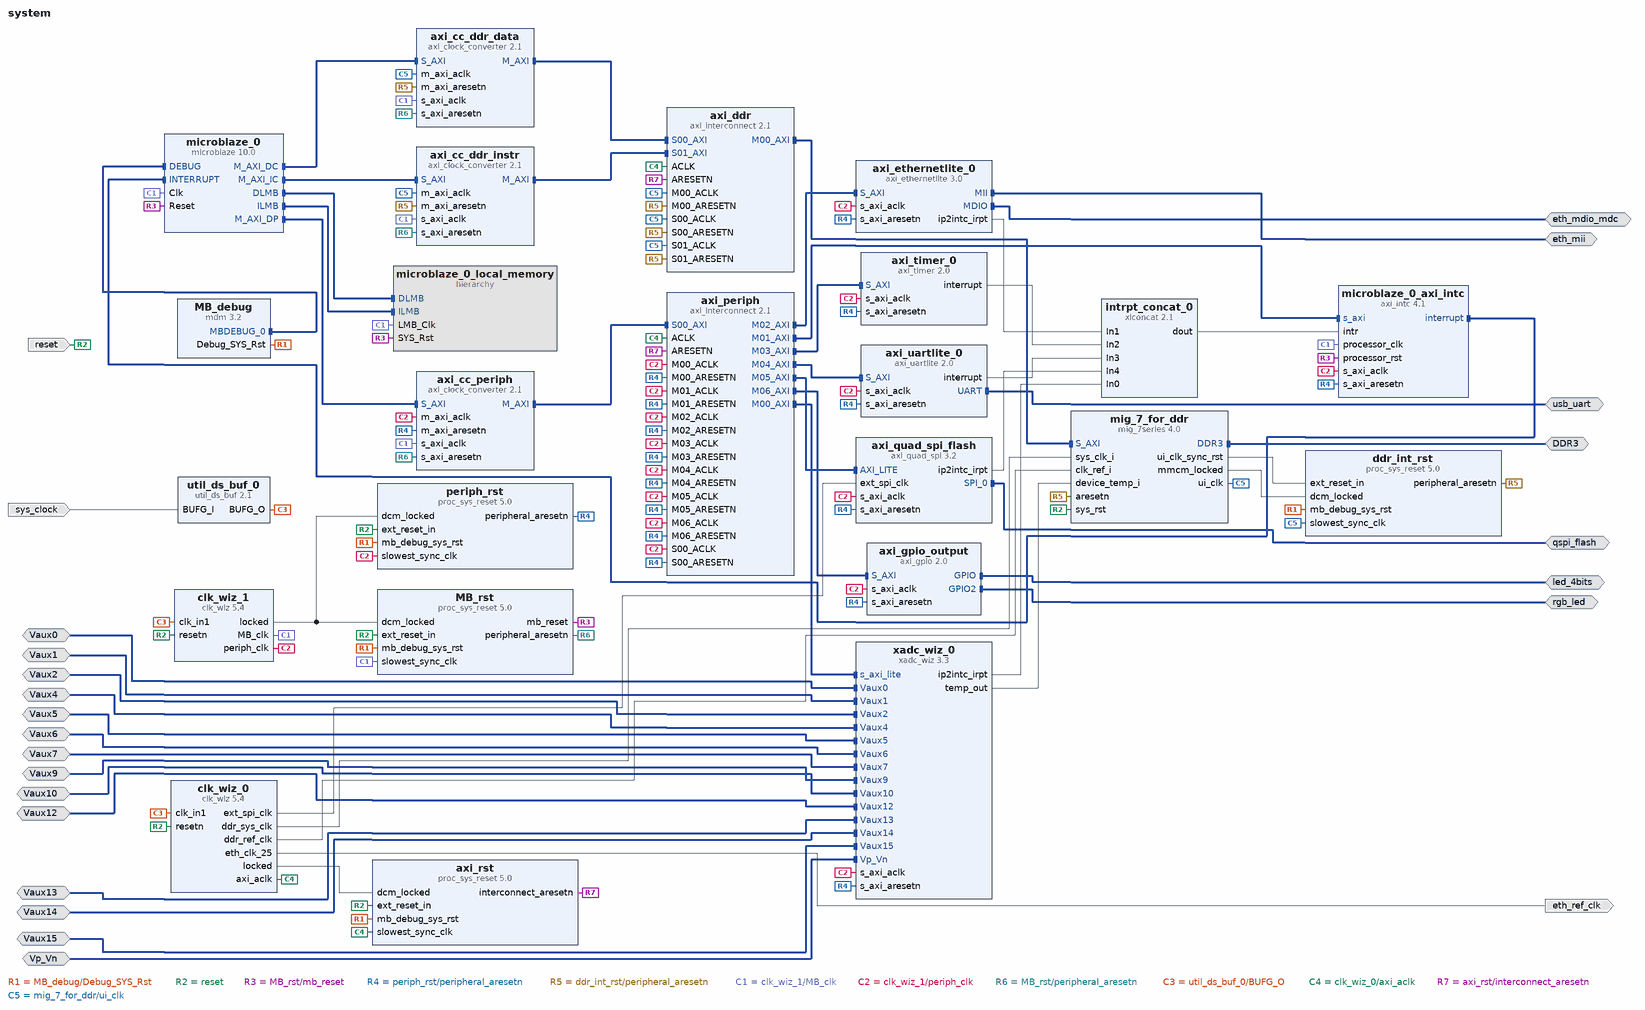
[diagram p0: block diagram of the top level]
# Vivado block design system, xc7a35ticsg324-1L, Vivado 2017.2
create_bd_design system

create_bd_intf_port -mode Master -vlnv xilinx.com:interface:ddrx_rtl:1.0 DDR3
create_bd_intf_port -mode Slave -vlnv xilinx.com:interface:diff_analog_io_rtl:1.0 Vaux0
create_bd_intf_port -mode Slave -vlnv xilinx.com:interface:diff_analog_io_rtl:1.0 Vaux1
create_bd_intf_port -mode Slave -vlnv xilinx.com:interface:diff_analog_io_rtl:1.0 Vaux2
create_bd_intf_port -mode Slave -vlnv xilinx.com:interface:diff_analog_io_rtl:1.0 Vaux4
create_bd_intf_port -mode Slave -vlnv xilinx.com:interface:diff_analog_io_rtl:1.0 Vaux5
create_bd_intf_port -mode Slave -vlnv xilinx.com:interface:diff_analog_io_rtl:1.0 Vaux6
create_bd_intf_port -mode Slave -vlnv xilinx.com:interface:diff_analog_io_rtl:1.0 Vaux7
create_bd_intf_port -mode Slave -vlnv xilinx.com:interface:diff_analog_io_rtl:1.0 Vaux9
create_bd_intf_port -mode Slave -vlnv xilinx.com:interface:diff_analog_io_rtl:1.0 Vaux10
create_bd_intf_port -mode Slave -vlnv xilinx.com:interface:diff_analog_io_rtl:1.0 Vaux12
create_bd_intf_port -mode Slave -vlnv xilinx.com:interface:diff_analog_io_rtl:1.0 Vaux13
create_bd_intf_port -mode Slave -vlnv xilinx.com:interface:diff_analog_io_rtl:1.0 Vaux14
create_bd_intf_port -mode Slave -vlnv xilinx.com:interface:diff_analog_io_rtl:1.0 Vaux15
create_bd_intf_port -mode Slave -vlnv xilinx.com:interface:diff_analog_io_rtl:1.0 Vp_Vn
create_bd_intf_port -mode Master -vlnv xilinx.com:interface:gpio_rtl:1.0 led_4bits
create_bd_intf_port -mode Master -vlnv xilinx.com:interface:spi_rtl:1.0 qspi_flash
create_bd_intf_port -mode Master -vlnv xilinx.com:interface:gpio_rtl:1.0 rgb_led
create_bd_intf_port -mode Master -vlnv xilinx.com:interface:uart_rtl:1.0 usb_uart
create_bd_intf_port -mode Master -vlnv xilinx.com:interface:mii_rtl:1.0 eth_mii
create_bd_intf_port -mode Master -vlnv xilinx.com:interface:mdio_rtl:1.0 eth_mdio_mdc
create_bd_port -dir I -type rst reset
set_property -dict {CONFIG.POLARITY ACTIVE_LOW} [get_bd_ports reset]
create_bd_port -dir O -type clk eth_ref_clk
create_bd_port -dir I -type clk sys_clock
set_property -dict {CONFIG.FREQ_HZ 100000000 CONFIG.PHASE 0.000} [get_bd_ports sys_clock]

create_bd_cell -type ip -vlnv xilinx.com:ip:axi_interconnect:2.1 axi_ddr
set_property -dict [list \
  CONFIG.NUM_SI 2 \
  CONFIG.NUM_MI 1 \
  CONFIG.STRATEGY 2 \
  CONFIG.ENABLE_ADVANCED_OPTIONS 1 \
  CONFIG.M00_HAS_DATA_FIFO 2 \
  CONFIG.S00_HAS_DATA_FIFO 2 \
  CONFIG.S01_HAS_DATA_FIFO 2 \
] [get_bd_cells axi_ddr]
create_bd_cell -type ip -vlnv xilinx.com:ip:axi_timer:2.0 axi_timer_0
create_bd_cell -type ip -vlnv xilinx.com:ip:mdm:3.2 MB_debug
create_bd_cell -type ip -vlnv xilinx.com:ip:microblaze:10.0 microblaze_0
set_property -dict [list \
  CONFIG.C_AREA_OPTIMIZED 2 \
  CONFIG.C_D_AXI 1 \
  CONFIG.C_D_LMB 1 \
  CONFIG.C_I_AXI 0 \
  CONFIG.C_I_LMB 1 \
  CONFIG.G_TEMPLATE_LIST 5 \
  CONFIG.G_USE_EXCEPTIONS 1 \
  CONFIG.C_USE_MSR_INSTR 1 \
  CONFIG.C_USE_PCMP_INSTR 1 \
  CONFIG.C_USE_BARREL 1 \
  CONFIG.C_USE_DIV 0 \
  CONFIG.C_USE_HW_MUL 1 \
  CONFIG.C_USE_FPU 0 \
  CONFIG.C_UNALIGNED_EXCEPTIONS 1 \
  CONFIG.C_ILL_OPCODE_EXCEPTION 1 \
  CONFIG.C_M_AXI_I_BUS_EXCEPTION 1 \
  CONFIG.C_M_AXI_D_BUS_EXCEPTION 1 \
  CONFIG.C_PVR 0 \
  CONFIG.C_DEBUG_ENABLED 1 \
  CONFIG.C_OPCODE_0x0_ILLEGAL 1 \
  CONFIG.C_USE_ICACHE 1 \
  CONFIG.C_ADDR_TAG_BITS 14 \
  CONFIG.C_CACHE_BYTE_SIZE 16384 \
  CONFIG.C_ICACHE_LINE_LEN 8 \
  CONFIG.C_ICACHE_VICTIMS 0 \
  CONFIG.C_ICACHE_STREAMS 0 \
  CONFIG.C_ICACHE_FORCE_TAG_LUTRAM 1 \
  CONFIG.C_USE_DCACHE 1 \
  CONFIG.C_DCACHE_ADDR_TAG 14 \
  CONFIG.C_DCACHE_BYTE_SIZE 16384 \
  CONFIG.C_DCACHE_LINE_LEN 8 \
  CONFIG.C_DCACHE_FORCE_TAG_LUTRAM 1 \
  CONFIG.C_USE_MMU 3 \
  CONFIG.C_MMU_DTLB_SIZE 4 \
  CONFIG.C_MMU_ITLB_SIZE 2 \
  CONFIG.C_MMU_ZONES 2 \
  CONFIG.C_USE_BRANCH_TARGET_CACHE 1 \
  CONFIG.C_BRANCH_TARGET_CACHE_SIZE 5 \
] [get_bd_cells microblaze_0]
create_bd_cell -type ip -vlnv xilinx.com:ip:axi_intc:4.1 microblaze_0_axi_intc
set_property -dict {CONFIG.C_IRQ_IS_LEVEL 0 CONFIG.C_HAS_FAST 1 CONFIG.C_ENABLE_ASYNC 1} [get_bd_cells microblaze_0_axi_intc]
create_bd_cell -type ip -vlnv xilinx.com:ip:axi_interconnect:2.1 axi_periph
set_property -dict [list \
  CONFIG.NUM_SI 1 \
  CONFIG.NUM_MI 7 \
  CONFIG.STRATEGY 2 \
  CONFIG.ENABLE_ADVANCED_OPTIONS 1 \
  CONFIG.M00_HAS_DATA_FIFO 0 \
  CONFIG.M01_HAS_DATA_FIFO 0 \
  CONFIG.M02_HAS_DATA_FIFO 0 \
  CONFIG.M03_HAS_DATA_FIFO 0 \
  CONFIG.M04_HAS_DATA_FIFO 0 \
  CONFIG.M05_HAS_DATA_FIFO 0 \
  CONFIG.M06_HAS_DATA_FIFO 0 \
  CONFIG.M07_HAS_DATA_FIFO 0 \
  CONFIG.M08_HAS_DATA_FIFO 1 \
  CONFIG.S00_HAS_DATA_FIFO 2 \
] [get_bd_cells axi_periph]
create_bd_cell -type hier microblaze_0_local_memory
create_bd_cell -type ip -vlnv xilinx.com:ip:xlconcat:2.1 intrpt_concat_0
set_property -dict {CONFIG.NUM_PORTS 5} [get_bd_cells intrpt_concat_0]
create_bd_cell -type ip -vlnv xilinx.com:ip:xadc_wiz:3.3 xadc_wiz_0
set_property -dict [list \
  CONFIG.INTERFACE_SELECTION Enable_AXI \
  CONFIG.XADC_STARUP_SELECTION channel_sequencer \
  CONFIG.SEQUENCER_MODE Continuous \
  CONFIG.ENABLE_RESET false \
  CONFIG.OT_ALARM false \
  CONFIG.USER_TEMP_ALARM true \
  CONFIG.VCCINT_ALARM true \
  CONFIG.VCCAUX_ALARM true \
  CONFIG.VCCINT_ALARM_LOWER 0.95 \
  CONFIG.VCCINT_ALARM_UPPER 0.98 \
  CONFIG.SINGLE_CHANNEL_SELECTION TEMPERATURE \
  CONFIG.EXTERNAL_MUX_CHANNEL VP_VN \
  CONFIG.CHANNEL_ENABLE_TEMPERATURE true \
  CONFIG.CHANNEL_ENABLE_VP_VN true \
  CONFIG.CHANNEL_ENABLE_VAUXP0_VAUXN0 true \
  CONFIG.CHANNEL_ENABLE_VAUXP1_VAUXN1 true \
  CONFIG.CHANNEL_ENABLE_VAUXP2_VAUXN2 true \
  CONFIG.CHANNEL_ENABLE_VAUXP4_VAUXN4 true \
  CONFIG.CHANNEL_ENABLE_VAUXP5_VAUXN5 true \
  CONFIG.CHANNEL_ENABLE_VAUXP6_VAUXN6 true \
  CONFIG.CHANNEL_ENABLE_VAUXP7_VAUXN7 true \
  CONFIG.CHANNEL_ENABLE_VAUXP9_VAUXN9 true \
  CONFIG.CHANNEL_ENABLE_VAUXP10_VAUXN10 true \
  CONFIG.CHANNEL_ENABLE_VAUXP11_VAUXN11 false \
  CONFIG.CHANNEL_ENABLE_VAUXP12_VAUXN12 true \
  CONFIG.CHANNEL_ENABLE_VAUXP13_VAUXN13 true \
  CONFIG.CHANNEL_ENABLE_VAUXP14_VAUXN14 true \
  CONFIG.CHANNEL_ENABLE_VAUXP15_VAUXN15 true \
  CONFIG.ENABLE_TEMP_BUS true \
] [get_bd_cells xadc_wiz_0]
create_bd_cell -type ip -vlnv xilinx.com:ip:axi_gpio:2.0 axi_gpio_output
set_property -dict [list \
  CONFIG.USE_BOARD_FLOW true \
  CONFIG.GPIO_BOARD_INTERFACE led_4bits \
  CONFIG.GPIO2_BOARD_INTERFACE rgb_led \
] [get_bd_cells axi_gpio_output]
create_bd_cell -type ip -vlnv xilinx.com:ip:axi_quad_spi:3.2 axi_quad_spi_flash
set_property -dict [list \
  CONFIG.C_SPI_MEMORY 2 \
  CONFIG.C_SPI_MODE 2 \
  CONFIG.C_FIFO_DEPTH 256 \
  CONFIG.C_TYPE_OF_AXI4_INTERFACE 0 \
  CONFIG.USE_BOARD_FLOW true \
  CONFIG.QSPI_BOARD_INTERFACE qspi_flash \
  CONFIG.C_S_AXI4_ID_WIDTH 0 \
] [get_bd_cells axi_quad_spi_flash]
create_bd_cell -type ip -vlnv xilinx.com:ip:clk_wiz:5.4 clk_wiz_0
set_property -dict [list \
  CONFIG.PRIMITIVE MMCM \
  CONFIG.CLKOUT2_USED true \
  CONFIG.CLKOUT3_USED true \
  CONFIG.CLKOUT4_USED true \
  CONFIG.CLKOUT5_USED true \
  CONFIG.CLKOUT6_USED false \
  CONFIG.CLKOUT7_USED false \
  CONFIG.NUM_OUT_CLKS 5 \
  CONFIG.CLK_OUT1_PORT ddr_sys_clk \
  CONFIG.CLK_OUT2_PORT ddr_ref_clk \
  CONFIG.CLK_OUT3_PORT eth_clk_25 \
  CONFIG.CLK_OUT4_PORT ext_spi_clk \
  CONFIG.CLK_OUT5_PORT axi_aclk \
  CONFIG.CLK_OUT6_PORT axi_ddr_clk_100 \
  CONFIG.CLK_OUT7_PORT ext_spi_clk \
  CONFIG.CLKOUT1_REQUESTED_OUT_FREQ 166.66666 \
  CONFIG.CLKOUT2_REQUESTED_OUT_FREQ 200.000 \
  CONFIG.CLKOUT3_REQUESTED_OUT_FREQ 25.000 \
  CONFIG.CLKOUT3_REQUESTED_PHASE 45 \
  CONFIG.CLKOUT4_REQUESTED_OUT_FREQ 100.000 \
  CONFIG.CLKOUT4_REQUESTED_PHASE 270 \
  CONFIG.CLKOUT5_REQUESTED_OUT_FREQ 100.000 \
  CONFIG.CLKOUT5_REQUESTED_PHASE 90 \
  CONFIG.CLKOUT6_REQUESTED_OUT_FREQ 100 \
  CONFIG.CLKOUT6_REQUESTED_PHASE 270 \
  CONFIG.CLKOUT7_REQUESTED_OUT_FREQ 100 \
  CONFIG.CLKOUT7_REQUESTED_PHASE 180 \
  CONFIG.PRIM_SOURCE Single_ended_clock_capable_pin \
  CONFIG.CLKOUT1_DRIVES BUFGCE \
  CONFIG.CLKOUT2_DRIVES BUFGCE \
  CONFIG.CLKOUT3_DRIVES BUFGCE \
  CONFIG.CLKOUT4_DRIVES BUFGCE \
  CONFIG.CLKOUT5_DRIVES BUFGCE \
  CONFIG.CLKOUT6_DRIVES BUFGCE \
  CONFIG.CLKOUT7_DRIVES BUFGCE \
  CONFIG.FEEDBACK_SOURCE FDBK_AUTO \
  CONFIG.USE_LOCKED true \
  CONFIG.RESET_PORT resetn \
  CONFIG.MMCM_DIVCLK_DIVIDE 1 \
  CONFIG.MMCM_CLKFBOUT_MULT_F 10.000 \
  CONFIG.MMCM_CLKIN1_PERIOD 10.000 \
  CONFIG.MMCM_CLKIN2_PERIOD 10.000 \
  CONFIG.MMCM_COMPENSATION ZHOLD \
  CONFIG.MMCM_CLKOUT0_DIVIDE_F 6.000 \
  CONFIG.MMCM_CLKOUT1_DIVIDE 5 \
  CONFIG.MMCM_CLKOUT2_DIVIDE 40 \
  CONFIG.MMCM_CLKOUT2_PHASE 45.000 \
  CONFIG.MMCM_CLKOUT3_DIVIDE 10 \
  CONFIG.MMCM_CLKOUT3_PHASE 270.000 \
  CONFIG.MMCM_CLKOUT4_DIVIDE 10 \
  CONFIG.MMCM_CLKOUT4_PHASE 90.000 \
  CONFIG.MMCM_CLKOUT5_DIVIDE 1 \
  CONFIG.MMCM_CLKOUT5_PHASE 270.000 \
  CONFIG.MMCM_CLKOUT6_DIVIDE 1 \
  CONFIG.MMCM_CLKOUT6_PHASE 180.000 \
  CONFIG.RESET_TYPE ACTIVE_LOW \
  CONFIG.USE_SAFE_CLOCK_STARTUP true \
  CONFIG.USE_BOARD_FLOW true \
  CONFIG.CLK_IN1_BOARD_INTERFACE sys_clock \
  CONFIG.RESET_BOARD_INTERFACE reset \
  CONFIG.CLKOUT1_JITTER 118.758 \
  CONFIG.CLKOUT1_PHASE_ERROR 98.575 \
  CONFIG.CLKOUT2_JITTER 114.829 \
  CONFIG.CLKOUT2_PHASE_ERROR 98.575 \
  CONFIG.CLKOUT3_JITTER 175.402 \
  CONFIG.CLKOUT3_PHASE_ERROR 98.575 \
  CONFIG.CLKOUT4_JITTER 130.958 \
  CONFIG.CLKOUT4_PHASE_ERROR 98.575 \
  CONFIG.CLKOUT5_JITTER 130.958 \
  CONFIG.CLKOUT5_PHASE_ERROR 98.575 \
  CONFIG.CLKOUT6_JITTER 130.958 \
  CONFIG.CLKOUT6_PHASE_ERROR 98.575 \
  CONFIG.CLKOUT7_JITTER 130.958 \
  CONFIG.CLKOUT7_PHASE_ERROR 98.575 \
] [get_bd_cells clk_wiz_0]
create_bd_cell -type ip -vlnv xilinx.com:ip:mig_7series:4.0 mig_7_for_ddr
set_property -dict [list \
  CONFIG.XML_INPUT_FILE mig_a.prj \
  CONFIG.RESET_BOARD_INTERFACE reset \
  CONFIG.MIG_DONT_TOUCH_PARAM Custom \
  CONFIG.BOARD_MIG_PARAM Custom \
] [get_bd_cells mig_7_for_ddr]
create_bd_cell -type ip -vlnv xilinx.com:ip:proc_sys_reset:5.0 MB_rst
set_property -dict {CONFIG.C_EXT_RESET_HIGH 0 CONFIG.USE_BOARD_FLOW true CONFIG.RESET_BOARD_INTERFACE reset} [get_bd_cells MB_rst]
create_bd_cell -type ip -vlnv xilinx.com:ip:axi_clock_converter:2.1 axi_cc_periph
set_property -dict {CONFIG.ACLK_ASYNC 1 CONFIG.SYNCHRONIZATION_STAGES 3 CONFIG.ACLK_RATIO 1:2} [get_bd_cells axi_cc_periph]
create_bd_cell -type ip -vlnv xilinx.com:ip:axi_clock_converter:2.1 axi_cc_ddr_data
set_property -dict {CONFIG.ACLK_ASYNC 1 CONFIG.SYNCHRONIZATION_STAGES 2} [get_bd_cells axi_cc_ddr_data]
create_bd_cell -type ip -vlnv xilinx.com:ip:axi_clock_converter:2.1 axi_cc_ddr_instr
set_property -dict {CONFIG.ACLK_ASYNC 1 CONFIG.SYNCHRONIZATION_STAGES 3 CONFIG.ACLK_RATIO 1:2} [get_bd_cells axi_cc_ddr_instr]
create_bd_cell -type ip -vlnv xilinx.com:ip:proc_sys_reset:5.0 periph_rst
set_property -dict [list \
  CONFIG.C_EXT_RESET_HIGH 0 \
  CONFIG.USE_BOARD_FLOW true \
  CONFIG.RESET_BOARD_INTERFACE reset \
] [get_bd_cells periph_rst]
create_bd_cell -type ip -vlnv xilinx.com:ip:proc_sys_reset:5.0 axi_rst
create_bd_cell -type ip -vlnv xilinx.com:ip:clk_wiz:5.4 clk_wiz_1
set_property -dict [list \
  CONFIG.CLKOUT2_USED true \
  CONFIG.CLKOUT3_USED false \
  CONFIG.NUM_OUT_CLKS 2 \
  CONFIG.CLK_OUT1_PORT periph_clk \
  CONFIG.CLK_OUT2_PORT MB_clk \
  CONFIG.CLK_OUT3_PORT axi_ddr_clk \
  CONFIG.CLKOUT1_REQUESTED_OUT_FREQ 115.000 \
  CONFIG.CLKOUT1_REQUESTED_PHASE 45 \
  CONFIG.CLKOUT2_REQUESTED_OUT_FREQ 115.000 \
  CONFIG.CLKOUT2_REQUESTED_PHASE 225 \
  CONFIG.CLKOUT3_REQUESTED_OUT_FREQ 75.000 \
  CONFIG.CLKOUT3_REQUESTED_PHASE 315 \
  CONFIG.CLKOUT1_DRIVES BUFGCE \
  CONFIG.CLKOUT2_DRIVES BUFGCE \
  CONFIG.CLKOUT3_DRIVES BUFGCE \
  CONFIG.CLKOUT4_DRIVES BUFGCE \
  CONFIG.CLKOUT5_DRIVES BUFGCE \
  CONFIG.CLKOUT6_DRIVES BUFGCE \
  CONFIG.CLKOUT7_DRIVES BUFGCE \
  CONFIG.FEEDBACK_SOURCE FDBK_AUTO \
  CONFIG.RESET_PORT resetn \
  CONFIG.MMCM_DIVCLK_DIVIDE 5 \
  CONFIG.MMCM_CLKFBOUT_MULT_F 51.750 \
  CONFIG.MMCM_CLKIN1_PERIOD 10.000 \
  CONFIG.MMCM_CLKIN2_PERIOD 10.000 \
  CONFIG.MMCM_CLKOUT0_DIVIDE_F 9.000 \
  CONFIG.MMCM_CLKOUT0_PHASE 45.000 \
  CONFIG.MMCM_CLKOUT1_DIVIDE 9 \
  CONFIG.MMCM_CLKOUT1_PHASE 225.000 \
  CONFIG.MMCM_CLKOUT2_DIVIDE 1 \
  CONFIG.MMCM_CLKOUT2_PHASE 315.000 \
  CONFIG.RESET_TYPE ACTIVE_LOW \
  CONFIG.USE_SAFE_CLOCK_STARTUP true \
  CONFIG.CLKOUT1_JITTER 227.127 \
  CONFIG.CLKOUT1_PHASE_ERROR 293.956 \
  CONFIG.CLKOUT2_JITTER 227.127 \
  CONFIG.CLKOUT2_PHASE_ERROR 293.956 \
  CONFIG.CLKOUT3_JITTER 265.901 \
  CONFIG.CLKOUT3_PHASE_ERROR 303.235 \
] [get_bd_cells clk_wiz_1]
create_bd_cell -type ip -vlnv xilinx.com:ip:util_ds_buf:2.1 util_ds_buf_0
set_property -dict {CONFIG.C_BUF_TYPE BUFG} [get_bd_cells util_ds_buf_0]
create_bd_cell -type ip -vlnv xilinx.com:ip:axi_uartlite:2.0 axi_uartlite_0
set_property -dict [list \
  CONFIG.C_BAUDRATE 115200 \
  CONFIG.USE_BOARD_FLOW true \
  CONFIG.UARTLITE_BOARD_INTERFACE usb_uart \
] [get_bd_cells axi_uartlite_0]
create_bd_cell -type ip -vlnv xilinx.com:ip:proc_sys_reset:5.0 ddr_int_rst
create_bd_cell -type ip -vlnv xilinx.com:ip:axi_ethernetlite:3.0 axi_ethernetlite_0
set_property -dict [list \
  CONFIG.C_INCLUDE_INTERNAL_LOOPBACK 1 \
  CONFIG.USE_BOARD_FLOW true \
  CONFIG.MII_BOARD_INTERFACE eth_mii \
  CONFIG.MDIO_BOARD_INTERFACE eth_mdio_mdc \
] [get_bd_cells axi_ethernetlite_0]

# ---- hierarchy /microblaze_0_local_memory ----
current_bd_instance /microblaze_0_local_memory
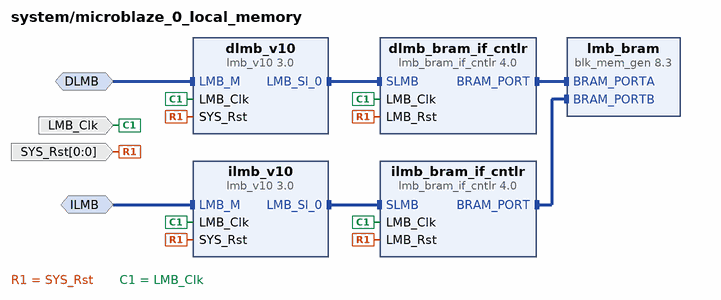
[diagram p1: block diagram inside /microblaze_0_local_memory]
create_bd_intf_pin -mode MirroredMaster -vlnv xilinx.com:interface:lmb_rtl:1.0 DLMB
create_bd_intf_pin -mode MirroredMaster -vlnv xilinx.com:interface:lmb_rtl:1.0 ILMB
create_bd_pin -dir I -type clk LMB_Clk
create_bd_pin -dir I -from 0 -to 0 -type rst SYS_Rst

create_bd_cell -type ip -vlnv xilinx.com:ip:lmb_bram_if_cntlr:4.0 dlmb_bram_if_cntlr
set_property -dict {CONFIG.C_ECC 0} [get_bd_cells dlmb_bram_if_cntlr]
create_bd_cell -type ip -vlnv xilinx.com:ip:lmb_v10:3.0 dlmb_v10
create_bd_cell -type ip -vlnv xilinx.com:ip:lmb_bram_if_cntlr:4.0 ilmb_bram_if_cntlr
set_property -dict {CONFIG.C_ECC 0} [get_bd_cells ilmb_bram_if_cntlr]
create_bd_cell -type ip -vlnv xilinx.com:ip:lmb_v10:3.0 ilmb_v10
create_bd_cell -type ip -vlnv xilinx.com:ip:blk_mem_gen:8.3 lmb_bram
set_property -dict {CONFIG.Memory_Type True_Dual_Port_RAM CONFIG.use_bram_block BRAM_Controller} [get_bd_cells lmb_bram]

# ---- connections ----

current_bd_instance /microblaze_0_local_memory
connect_bd_intf_net -intf_net microblaze_0_dlmb_bus [get_bd_intf_pins dlmb_bram_if_cntlr/SLMB] [get_bd_intf_pins dlmb_v10/LMB_Sl_0]
connect_bd_intf_net -intf_net microblaze_0_dlmb_cntlr [get_bd_intf_pins dlmb_bram_if_cntlr/BRAM_PORT] [get_bd_intf_pins lmb_bram/BRAM_PORTA]
connect_bd_intf_net -intf_net microblaze_0_ilmb_bus [get_bd_intf_pins ilmb_bram_if_cntlr/SLMB] [get_bd_intf_pins ilmb_v10/LMB_Sl_0]
connect_bd_intf_net -intf_net microblaze_0_ilmb_cntlr [get_bd_intf_pins ilmb_bram_if_cntlr/BRAM_PORT] [get_bd_intf_pins lmb_bram/BRAM_PORTB]
connect_bd_intf_net -intf_net microblaze_0_dlmb [get_bd_intf_pins DLMB] [get_bd_intf_pins dlmb_v10/LMB_M]
connect_bd_intf_net -intf_net microblaze_0_ilmb [get_bd_intf_pins ILMB] [get_bd_intf_pins ilmb_v10/LMB_M]
connect_bd_net [get_bd_pins SYS_Rst] \
  [get_bd_pins dlmb_bram_if_cntlr/LMB_Rst] [get_bd_pins dlmb_v10/SYS_Rst] [get_bd_pins ilmb_bram_if_cntlr/LMB_Rst] \
  [get_bd_pins ilmb_v10/SYS_Rst]
connect_bd_net -net microblaze_0_Clk [get_bd_pins LMB_Clk] \
  [get_bd_pins dlmb_bram_if_cntlr/LMB_Clk] [get_bd_pins dlmb_v10/LMB_Clk] [get_bd_pins ilmb_bram_if_cntlr/LMB_Clk] \
  [get_bd_pins ilmb_v10/LMB_Clk]

current_bd_instance /
connect_bd_intf_net -intf_net axi_mem_intercon_M00_AXI [get_bd_intf_pins axi_ddr/M00_AXI] [get_bd_intf_pins mig_7_for_ddr/S_AXI]
connect_bd_intf_net [get_bd_intf_pins MB_debug/MBDEBUG_0] [get_bd_intf_pins microblaze_0/DEBUG]
connect_bd_intf_net [get_bd_intf_pins microblaze_0/DLMB] [get_bd_intf_pins microblaze_0_local_memory/DLMB]
connect_bd_intf_net [get_bd_intf_pins microblaze_0/ILMB] [get_bd_intf_pins microblaze_0_local_memory/ILMB]
connect_bd_intf_net [get_bd_intf_pins microblaze_0/INTERRUPT] [get_bd_intf_pins microblaze_0_axi_intc/interrupt]
connect_bd_intf_net [get_bd_intf_pins microblaze_0/M_AXI_DP] [get_bd_intf_pins axi_cc_periph/S_AXI]
connect_bd_intf_net -intf_net axi_clock_converter_1_M_AXI [get_bd_intf_pins axi_cc_periph/M_AXI] [get_bd_intf_pins axi_periph/S00_AXI]
connect_bd_intf_net [get_bd_intf_pins microblaze_0/M_AXI_DC] [get_bd_intf_pins axi_cc_ddr_data/S_AXI]
connect_bd_intf_net -intf_net axi_ddr_data_M_AXI [get_bd_intf_pins axi_cc_ddr_data/M_AXI] [get_bd_intf_pins axi_ddr/S00_AXI]
connect_bd_intf_net [get_bd_intf_pins microblaze_0/M_AXI_IC] [get_bd_intf_pins axi_cc_ddr_instr/S_AXI]
connect_bd_intf_net -intf_net axi_ddr_instr_M_AXI [get_bd_intf_pins axi_cc_ddr_instr/M_AXI] [get_bd_intf_pins axi_ddr/S01_AXI]
connect_bd_intf_net [get_bd_intf_pins axi_periph/M00_AXI] [get_bd_intf_pins xadc_wiz_0/s_axi_lite]
connect_bd_intf_net [get_bd_intf_pins microblaze_0_axi_intc/s_axi] [get_bd_intf_pins axi_periph/M01_AXI]
connect_bd_intf_net [get_bd_intf_pins axi_timer_0/S_AXI] [get_bd_intf_pins axi_periph/M03_AXI]
connect_bd_intf_net [get_bd_intf_pins axi_uartlite_0/S_AXI] [get_bd_intf_pins axi_periph/M04_AXI]
connect_bd_intf_net [get_bd_intf_pins axi_quad_spi_flash/AXI_LITE] [get_bd_intf_pins axi_periph/M05_AXI]
connect_bd_intf_net [get_bd_intf_pins axi_gpio_output/S_AXI] [get_bd_intf_pins axi_periph/M06_AXI]
connect_bd_intf_net [get_bd_intf_pins axi_ethernetlite_0/S_AXI] [get_bd_intf_pins axi_periph/M02_AXI]
connect_bd_intf_net -intf_net mig_7series_0_DDR3 [get_bd_intf_ports DDR3] [get_bd_intf_pins mig_7_for_ddr/DDR3]
connect_bd_intf_net -intf_net Vaux0_1 [get_bd_intf_ports Vaux0] [get_bd_intf_pins xadc_wiz_0/Vaux0]
connect_bd_intf_net -intf_net Vaux1_1 [get_bd_intf_ports Vaux1] [get_bd_intf_pins xadc_wiz_0/Vaux1]
connect_bd_intf_net -intf_net Vaux2_1 [get_bd_intf_ports Vaux2] [get_bd_intf_pins xadc_wiz_0/Vaux2]
connect_bd_intf_net -intf_net Vaux4_1 [get_bd_intf_ports Vaux4] [get_bd_intf_pins xadc_wiz_0/Vaux4]
connect_bd_intf_net -intf_net Vaux5_1 [get_bd_intf_ports Vaux5] [get_bd_intf_pins xadc_wiz_0/Vaux5]
connect_bd_intf_net -intf_net Vaux6_1 [get_bd_intf_ports Vaux6] [get_bd_intf_pins xadc_wiz_0/Vaux6]
connect_bd_intf_net -intf_net Vaux7_1 [get_bd_intf_ports Vaux7] [get_bd_intf_pins xadc_wiz_0/Vaux7]
connect_bd_intf_net -intf_net Vaux9_1 [get_bd_intf_ports Vaux9] [get_bd_intf_pins xadc_wiz_0/Vaux9]
connect_bd_intf_net -intf_net Vaux10_1 [get_bd_intf_ports Vaux10] [get_bd_intf_pins xadc_wiz_0/Vaux10]
connect_bd_intf_net -intf_net Vaux12_1 [get_bd_intf_ports Vaux12] [get_bd_intf_pins xadc_wiz_0/Vaux12]
connect_bd_intf_net -intf_net Vaux13_1 [get_bd_intf_ports Vaux13] [get_bd_intf_pins xadc_wiz_0/Vaux13]
connect_bd_intf_net -intf_net Vaux14_1 [get_bd_intf_ports Vaux14] [get_bd_intf_pins xadc_wiz_0/Vaux14]
connect_bd_intf_net -intf_net Vaux15_1 [get_bd_intf_ports Vaux15] [get_bd_intf_pins xadc_wiz_0/Vaux15]
connect_bd_intf_net [get_bd_intf_ports Vp_Vn] [get_bd_intf_pins xadc_wiz_0/Vp_Vn]
connect_bd_intf_net -intf_net axi_gpio_2_GPIO [get_bd_intf_ports led_4bits] [get_bd_intf_pins axi_gpio_output/GPIO]
connect_bd_intf_net -intf_net axi_quad_spi_1_SPI_0 [get_bd_intf_ports qspi_flash] [get_bd_intf_pins axi_quad_spi_flash/SPI_0]
connect_bd_intf_net -intf_net axi_gpio_2_GPIO2 [get_bd_intf_ports rgb_led] [get_bd_intf_pins axi_gpio_output/GPIO2]
connect_bd_intf_net [get_bd_intf_ports usb_uart] [get_bd_intf_pins axi_uartlite_0/UART]
connect_bd_intf_net [get_bd_intf_ports eth_mii] [get_bd_intf_pins axi_ethernetlite_0/MII]
connect_bd_intf_net [get_bd_intf_ports eth_mdio_mdc] [get_bd_intf_pins axi_ethernetlite_0/MDIO]
connect_bd_net -net MB_debug_rst [get_bd_pins MB_debug/Debug_SYS_Rst] \
  [get_bd_pins MB_rst/mb_debug_sys_rst] [get_bd_pins periph_rst/mb_debug_sys_rst] [get_bd_pins axi_rst/mb_debug_sys_rst] \
  [get_bd_pins ddr_int_rst/mb_debug_sys_rst]
connect_bd_net -net microblaze_0_intr [get_bd_pins intrpt_concat_0/dout] [get_bd_pins microblaze_0_axi_intc/intr]
connect_bd_net -net reset_input [get_bd_ports reset] \
  [get_bd_pins mig_7_for_ddr/sys_rst] [get_bd_pins MB_rst/ext_reset_in] [get_bd_pins periph_rst/ext_reset_in] \
  [get_bd_pins axi_rst/ext_reset_in] [get_bd_pins clk_wiz_1/resetn] [get_bd_pins clk_wiz_0/resetn]
connect_bd_net -net MB_reset [get_bd_pins MB_rst/mb_reset] \
  [get_bd_pins microblaze_0/Reset] [get_bd_pins microblaze_0_axi_intc/processor_rst] \
  [get_bd_pins microblaze_0_local_memory/SYS_Rst]
connect_bd_net -net peripheral_aresetn [get_bd_pins periph_rst/peripheral_aresetn] \
  [get_bd_pins axi_timer_0/s_axi_aresetn] [get_bd_pins microblaze_0_axi_intc/s_axi_aresetn] \
  [get_bd_pins xadc_wiz_0/s_axi_aresetn] [get_bd_pins axi_gpio_output/s_axi_aresetn] \
  [get_bd_pins axi_quad_spi_flash/s_axi_aresetn] [get_bd_pins axi_cc_periph/m_axi_aresetn] \
  [get_bd_pins axi_uartlite_0/s_axi_aresetn] [get_bd_pins axi_ethernetlite_0/s_axi_aresetn] \
  [get_bd_pins axi_periph/M00_ARESETN] [get_bd_pins axi_periph/M01_ARESETN] [get_bd_pins axi_periph/M02_ARESETN] \
  [get_bd_pins axi_periph/M03_ARESETN] [get_bd_pins axi_periph/M04_ARESETN] [get_bd_pins axi_periph/M05_ARESETN] \
  [get_bd_pins axi_periph/M06_ARESETN] [get_bd_pins axi_periph/S00_ARESETN]
connect_bd_net -net ddr_intrnl_aresetn [get_bd_pins ddr_int_rst/peripheral_aresetn] \
  [get_bd_pins mig_7_for_ddr/aresetn] [get_bd_pins axi_cc_ddr_instr/m_axi_aresetn] \
  [get_bd_pins axi_cc_ddr_data/m_axi_aresetn] [get_bd_pins axi_ddr/M00_ARESETN] [get_bd_pins axi_ddr/S00_ARESETN] \
  [get_bd_pins axi_ddr/S01_ARESETN]
connect_bd_net [get_bd_pins xadc_wiz_0/temp_out] [get_bd_pins mig_7_for_ddr/device_temp_i]
connect_bd_net -net MB_clk [get_bd_pins clk_wiz_1/MB_clk] \
  [get_bd_pins microblaze_0/Clk] [get_bd_pins MB_rst/slowest_sync_clk] [get_bd_pins microblaze_0_axi_intc/processor_clk] \
  [get_bd_pins axi_cc_ddr_data/s_axi_aclk] [get_bd_pins axi_cc_ddr_instr/s_axi_aclk] [get_bd_pins axi_cc_periph/s_axi_aclk] \
  [get_bd_pins microblaze_0_local_memory/LMB_Clk]
connect_bd_net -net clk_wiz_1_eth_clk_25 [get_bd_pins clk_wiz_0/eth_clk_25] [get_bd_ports eth_ref_clk]
connect_bd_net -net periph_clk [get_bd_pins clk_wiz_1/periph_clk] \
  [get_bd_pins axi_gpio_output/s_axi_aclk] [get_bd_pins axi_quad_spi_flash/s_axi_aclk] [get_bd_pins axi_timer_0/s_axi_aclk] \
  [get_bd_pins microblaze_0_axi_intc/s_axi_aclk] [get_bd_pins xadc_wiz_0/s_axi_aclk] [get_bd_pins axi_cc_periph/m_axi_aclk] \
  [get_bd_pins periph_rst/slowest_sync_clk] [get_bd_pins axi_uartlite_0/s_axi_aclk] \
  [get_bd_pins axi_ethernetlite_0/s_axi_aclk] [get_bd_pins axi_periph/M06_ACLK] [get_bd_pins axi_periph/M05_ACLK] \
  [get_bd_pins axi_periph/M04_ACLK] [get_bd_pins axi_periph/M03_ACLK] [get_bd_pins axi_periph/M02_ACLK] \
  [get_bd_pins axi_periph/M01_ACLK] [get_bd_pins axi_periph/M00_ACLK] [get_bd_pins axi_periph/S00_ACLK]
connect_bd_net -net MB_cc_aresetn [get_bd_pins MB_rst/peripheral_aresetn] \
  [get_bd_pins axi_cc_ddr_instr/s_axi_aresetn] [get_bd_pins axi_cc_ddr_data/s_axi_aresetn] \
  [get_bd_pins axi_cc_periph/s_axi_aresetn]
connect_bd_net [get_bd_pins clk_wiz_1/locked] [get_bd_pins periph_rst/dcm_locked] [get_bd_pins MB_rst/dcm_locked]
connect_bd_net [get_bd_ports sys_clock] [get_bd_pins util_ds_buf_0/BUFG_I]
connect_bd_net [get_bd_pins util_ds_buf_0/BUFG_O] [get_bd_pins clk_wiz_0/clk_in1] [get_bd_pins clk_wiz_1/clk_in1]
connect_bd_net [get_bd_pins clk_wiz_0/ddr_sys_clk] [get_bd_pins mig_7_for_ddr/sys_clk_i]
connect_bd_net [get_bd_pins clk_wiz_0/ddr_ref_clk] [get_bd_pins mig_7_for_ddr/clk_ref_i]
connect_bd_net [get_bd_pins clk_wiz_0/ext_spi_clk] [get_bd_pins axi_quad_spi_flash/ext_spi_clk]
connect_bd_net [get_bd_pins clk_wiz_0/axi_aclk] [get_bd_pins axi_rst/slowest_sync_clk] [get_bd_pins axi_periph/ACLK] [get_bd_pins axi_ddr/ACLK]
connect_bd_net -net interconnect_aresetn [get_bd_pins axi_rst/interconnect_aresetn] [get_bd_pins axi_ddr/ARESETN] [get_bd_pins axi_periph/ARESETN]
connect_bd_net -net xadc_irpt [get_bd_pins xadc_wiz_0/ip2intc_irpt] [get_bd_pins intrpt_concat_0/In0]
connect_bd_net -net axi_timer_irpt [get_bd_pins axi_timer_0/interrupt] [get_bd_pins intrpt_concat_0/In2]
connect_bd_net [get_bd_pins clk_wiz_0/locked] [get_bd_pins axi_rst/dcm_locked]
connect_bd_net -net axi_uartlite_0_irpt [get_bd_pins axi_uartlite_0/interrupt] [get_bd_pins intrpt_concat_0/In3]
connect_bd_net -net axi_quad_spi_flash_irpt [get_bd_pins axi_quad_spi_flash/ip2intc_irpt] [get_bd_pins intrpt_concat_0/In4]
connect_bd_net -net mig_7series_0_ui_clk_sync_rst [get_bd_pins mig_7_for_ddr/ui_clk_sync_rst] [get_bd_pins ddr_int_rst/ext_reset_in]
connect_bd_net -net mig_mmcm_locked [get_bd_pins mig_7_for_ddr/mmcm_locked] [get_bd_pins ddr_int_rst/dcm_locked]
connect_bd_net -net mig_7series_0_ui_clk [get_bd_pins mig_7_for_ddr/ui_clk] \
  [get_bd_pins ddr_int_rst/slowest_sync_clk] [get_bd_pins axi_cc_ddr_instr/m_axi_aclk] \
  [get_bd_pins axi_cc_ddr_data/m_axi_aclk] [get_bd_pins axi_ddr/S00_ACLK] [get_bd_pins axi_ddr/M00_ACLK] \
  [get_bd_pins axi_ddr/S01_ACLK]
connect_bd_net -net axi_ethernetlite_irpt [get_bd_pins axi_ethernetlite_0/ip2intc_irpt] [get_bd_pins intrpt_concat_0/In1]

# ---- address map ----
assign_bd_address -offset 0x00000000 -range 32K -target_address_space [get_bd_addr_spaces microblaze_0/Data] [get_bd_addr_segs microblaze_0_local_memory/dlmb_bram_if_cntlr/SLMB/Mem]
assign_bd_address -offset 0x40010000 -range 64K -target_address_space [get_bd_addr_spaces microblaze_0/Data] [get_bd_addr_segs axi_gpio_output/S_AXI/Reg]
assign_bd_address -offset 0x40600000 -range 64K -target_address_space [get_bd_addr_spaces microblaze_0/Data] [get_bd_addr_segs axi_uartlite_0/S_AXI/Reg]
assign_bd_address -offset 0x40E00000 -range 64K -target_address_space [get_bd_addr_spaces microblaze_0/Data] [get_bd_addr_segs axi_ethernetlite_0/S_AXI/Reg]
assign_bd_address -offset 0x41200000 -range 64K -target_address_space [get_bd_addr_spaces microblaze_0/Data] [get_bd_addr_segs microblaze_0_axi_intc/S_AXI/Reg]
assign_bd_address -offset 0x41C00000 -range 64K -target_address_space [get_bd_addr_spaces microblaze_0/Data] [get_bd_addr_segs axi_timer_0/S_AXI/Reg]
assign_bd_address -offset 0x44A10000 -range 64K -target_address_space [get_bd_addr_spaces microblaze_0/Data] [get_bd_addr_segs axi_quad_spi_flash/AXI_LITE/Reg]
assign_bd_address -offset 0x44A20000 -range 64K -target_address_space [get_bd_addr_spaces microblaze_0/Data] [get_bd_addr_segs xadc_wiz_0/s_axi_lite/Reg]
assign_bd_address -offset 0x80000000 -range 256M -target_address_space [get_bd_addr_spaces microblaze_0/Data] [get_bd_addr_segs mig_7_for_ddr/memmap/memaddr]
assign_bd_address -offset 0x00000000 -range 64K -target_address_space [get_bd_addr_spaces microblaze_0/Instruction] [get_bd_addr_segs microblaze_0_local_memory/ilmb_bram_if_cntlr/SLMB/Mem]
assign_bd_address -offset 0x80000000 -range 256M -target_address_space [get_bd_addr_spaces microblaze_0/Instruction] [get_bd_addr_segs mig_7_for_ddr/memmap/memaddr]
exclude_bd_addr_seg -offset 0x40010000 -range 64K -target_address_space [get_bd_addr_spaces microblaze_0/Instruction] [get_bd_addr_segs axi_gpio_output/S_AXI/Reg]
exclude_bd_addr_seg -offset 0x41200000 -range 64K -target_address_space [get_bd_addr_spaces microblaze_0/Instruction] [get_bd_addr_segs microblaze_0_axi_intc/S_AXI/Reg]
exclude_bd_addr_seg -offset 0x41C00000 -range 64K -target_address_space [get_bd_addr_spaces microblaze_0/Instruction] [get_bd_addr_segs axi_timer_0/S_AXI/Reg]
exclude_bd_addr_seg -offset 0x44A10000 -range 64K -target_address_space [get_bd_addr_spaces microblaze_0/Instruction] [get_bd_addr_segs axi_quad_spi_flash/AXI_LITE/Reg]
exclude_bd_addr_seg -offset 0x44A20000 -range 64K -target_address_space [get_bd_addr_spaces microblaze_0/Instruction] [get_bd_addr_segs xadc_wiz_0/s_axi_lite/Reg]

validate_bd_design
save_bd_design
